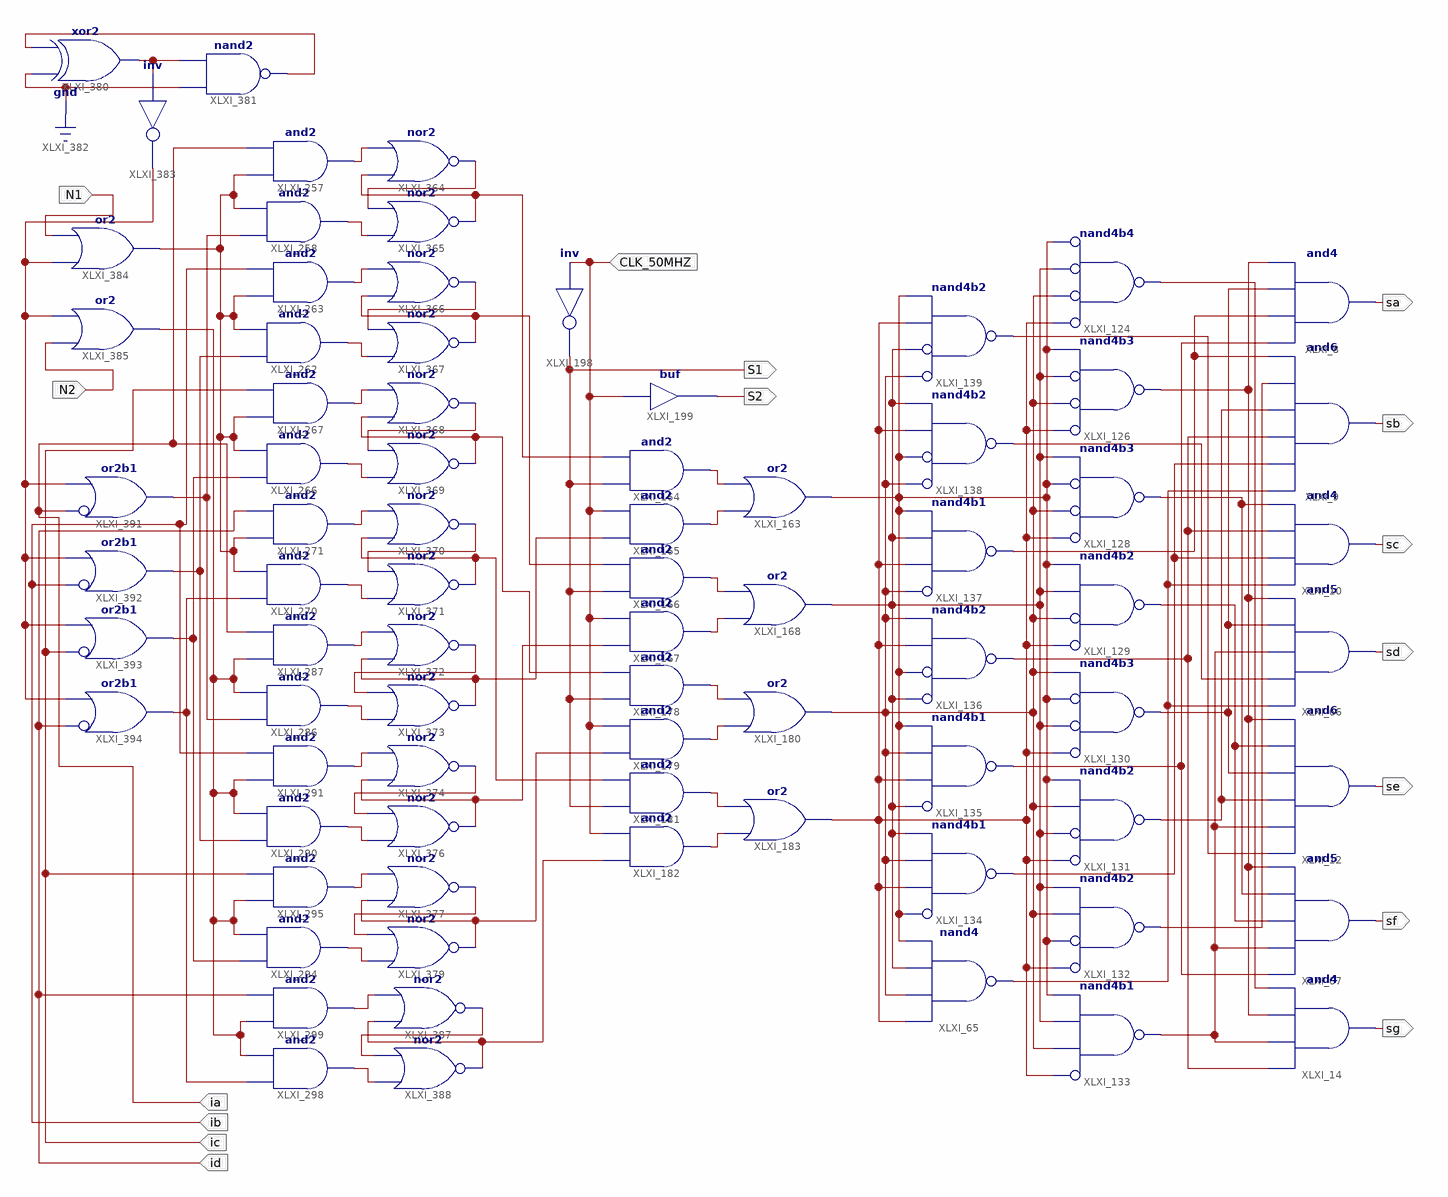
[diagram p0: schematic sheet 1]
// Xilinx ISE schematic test.sch (spartan3e) as structural Verilog: 77 symbols, 16 ports
module test (
  input  CLK_50MHZ,
  input  N1,
  input  N2,
  input  ia,
  input  ib,
  input  ic,
  input  id,
  output sa,
  output sc,
  output sb,
  output se,
  output sg,
  output sd,
  output sf,
  output S1,
  output S2
);

  wire A, B, C, D, XLXN_63, XLXN_64, XLXN_65, XLXN_68, XLXN_72, XLXN_77, XLXN_82, XLXN_83, XLXN_85, XLXN_87,
       XLXN_89, XLXN_119, XLXN_141, XLXN_142, XLXN_159, XLXN_203, XLXN_204, XLXN_205, XLXN_206, XLXN_213,
       XLXN_214, XLXN_215, XLXN_216, XLXN_289, XLXN_290, XLXN_292, XLXN_293, XLXN_297, XLXN_298, XLXN_299,
       XLXN_301, XLXN_303, XLXN_304, XLXN_305, XLXN_307, XLXN_309, XLXN_310, XLXN_311, XLXN_313, XLXN_333,
       XLXN_335, XLXN_337, XLXN_339, XLXN_341, XLXN_343, XLXN_345, XLXN_347, XLXN_349, XLXN_474, XLXN_475,
       XLXN_487, XLXN_488, XLXN_500, XLXN_501, XLXN_502, XLXN_511, XLXN_513, XLXN_514, XLXN_515, XLXN_526,
       XLXN_528, XLXN_531, XLXN_533, XLXN_535;

  nand XLXI_126 (XLXN_63, ~D, ~C, ~B, A);  // nand4b3
  nand XLXI_128 (XLXN_64, ~D, ~C, ~A, B);  // nand4b3
  nand XLXI_129 (XLXN_65, ~D, ~C, B, A);  // nand4b2
  nand XLXI_130 (XLXN_68, ~D, ~B, ~A, C);  // nand4b3
  nand XLXI_131 (XLXN_72, ~D, ~B, C, A);  // nand4b2
  nand XLXI_132 (XLXN_159, ~D, ~A, C, B);  // nand4b2
  nand XLXI_133 (XLXN_77, ~D, C, B, A);  // nand4b1
  nand XLXI_139 (XLXN_142, ~C, ~B, D, A);  // nand4b2
  nand XLXI_138 (XLXN_119, ~C, ~A, D, B);  // nand4b2
  nand XLXI_137 (XLXN_82, ~C, D, B, A);  // nand4b1
  nand XLXI_136 (XLXN_83, ~B, ~A, D, C);  // nand4b2
  nand XLXI_135 (XLXN_85, ~B, D, C, A);  // nand4b1
  nand XLXI_134 (XLXN_87, ~A, D, C, B);  // nand4b1
  nand XLXI_65 (XLXN_89, D, C, B, A);
  nand XLXI_124 (XLXN_141, ~D, ~C, ~B, ~A);  // nand4b4
  and XLXI_12 (se, XLXN_142, XLXN_77, XLXN_72, XLXN_68, XLXN_65, XLXN_63);
  and XLXI_67 (sf, XLXN_85, XLXN_77, XLXN_65, XLXN_64, XLXN_63);
  and XLXI_66 (sd, XLXN_89, XLXN_119, XLXN_77, XLXN_68, XLXN_63);
  and XLXI_10 (sc, XLXN_89, XLXN_87, XLXN_83, XLXN_64);
  and XLXI_9 (sb, XLXN_89, XLXN_87, XLXN_83, XLXN_72, XLXN_159, XLXN_82);
  and XLXI_8 (sa, XLXN_85, XLXN_82, XLXN_68, XLXN_63);
  and XLXI_14 (sg, XLXN_83, XLXN_77, XLXN_63, XLXN_141);
  and XLXI_164 (XLXN_204, S1, XLXN_290);
  and XLXI_165 (XLXN_203, XLXN_333, CLK_50MHZ);
  or XLXI_163 (A, XLXN_203, XLXN_204);
  and XLXI_166 (XLXN_206, S1, XLXN_297);
  and XLXI_167 (XLXN_205, XLXN_339, CLK_50MHZ);
  or XLXI_168 (B, XLXN_205, XLXN_206);
  and XLXI_178 (XLXN_214, S1, XLXN_303);
  and XLXI_179 (XLXN_213, XLXN_345, CLK_50MHZ);
  or XLXI_180 (C, XLXN_213, XLXN_214);
  and XLXI_181 (XLXN_216, S1, XLXN_309);
  and XLXI_182 (XLXN_215, XLXN_515, CLK_50MHZ);
  or XLXI_183 (D, XLXN_215, XLXN_216);
  not XLXI_198 (S1, CLK_50MHZ);
  buf XLXI_199 (S2, CLK_50MHZ);
  and XLXI_286 (XLXN_335, XLXN_526, XLXN_488);
  and XLXI_287 (XLXN_337, XLXN_488, ia);
  and XLXI_290 (XLXN_341, XLXN_528, XLXN_488);
  and XLXI_291 (XLXN_343, XLXN_488, ib);
  and XLXI_294 (XLXN_347, XLXN_531, XLXN_488);
  and XLXI_295 (XLXN_349, XLXN_488, ic);
  and XLXI_298 (XLXN_511, XLXN_533, XLXN_488);
  and XLXI_299 (XLXN_513, XLXN_488, id);
  and XLXI_258 (XLXN_292, XLXN_526, XLXN_487);
  and XLXI_257 (XLXN_293, XLXN_487, ia);
  and XLXI_262 (XLXN_299, XLXN_528, XLXN_487);
  and XLXI_263 (XLXN_301, XLXN_487, ib);
  and XLXI_266 (XLXN_305, XLXN_531, XLXN_487);
  and XLXI_267 (XLXN_307, XLXN_487, ic);
  and XLXI_270 (XLXN_311, XLXN_533, XLXN_487);
  and XLXI_271 (XLXN_313, XLXN_487, id);
  nor XLXI_364 (XLXN_289, XLXN_290, XLXN_293);
  nor XLXI_365 (XLXN_290, XLXN_292, XLXN_289);
  nor XLXI_366 (XLXN_298, XLXN_297, XLXN_301);
  nor XLXI_367 (XLXN_297, XLXN_299, XLXN_298);
  nor XLXI_368 (XLXN_304, XLXN_303, XLXN_307);
  nor XLXI_369 (XLXN_303, XLXN_305, XLXN_304);
  nor XLXI_370 (XLXN_310, XLXN_309, XLXN_313);
  nor XLXI_371 (XLXN_309, XLXN_311, XLXN_310);
  nor XLXI_372 (XLXN_500, XLXN_333, XLXN_337);
  nor XLXI_373 (XLXN_333, XLXN_335, XLXN_500);
  nor XLXI_374 (XLXN_501, XLXN_339, XLXN_343);
  nor XLXI_376 (XLXN_339, XLXN_341, XLXN_501);
  nor XLXI_377 (XLXN_502, XLXN_345, XLXN_349);
  nor XLXI_379 (XLXN_345, XLXN_347, XLXN_502);
  xor XLXI_380 (XLXN_475, 1'b0, XLXN_474);
  nand XLXI_381 (XLXN_474, 1'b0, XLXN_475);
  not XLXI_383 (XLXN_535, XLXN_475);
  or XLXI_384 (XLXN_487, XLXN_535, N1);
  or XLXI_385 (XLXN_488, N2, XLXN_535);
  nor XLXI_387 (XLXN_514, XLXN_515, XLXN_513);
  nor XLXI_388 (XLXN_515, XLXN_511, XLXN_514);
  or XLXI_391 (XLXN_526, ~ia, XLXN_535);  // or2b1
  or XLXI_392 (XLXN_528, ~ib, XLXN_535);  // or2b1
  or XLXI_393 (XLXN_531, ~ic, XLXN_535);  // or2b1
  or XLXI_394 (XLXN_533, ~id, XLXN_535);  // or2b1
endmodule
